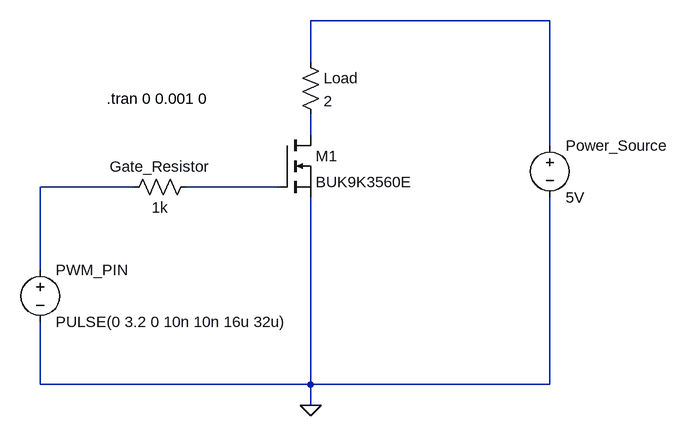
[diagram p0: schematic MosfetDriver.asc]
MosfetDriver.asc, the LTspice schematic file:
Version 4
SHEET 1 1028 680
WIRE 832 -224 464 -224
WIRE 464 -160 464 -224
WIRE 464 -48 464 -80
WIRE 832 -32 832 -224
WIRE 192 32 48 32
WIRE 416 32 272 32
WIRE 48 160 48 32
WIRE 48 336 48 240
WIRE 464 336 464 48
WIRE 464 336 48 336
WIRE 832 336 832 48
WIRE 832 336 464 336
WIRE 464 368 464 336
FLAG 464 368 0
SYMBOL voltage 48 144 R0
WINDOW 123 0 0 Left 0
WINDOW 39 0 0 Left 0
SYMATTR InstName PWM_PIN
SYMATTR Value PULSE(0 3.2 0 10n 10n 16u 32u)
SYMBOL nmos 416 -48 R0
SYMATTR InstName M1
SYMATTR Value BUK9K3560E
SYMBOL voltage 832 -48 R0
WINDOW 123 0 0 Left 0
WINDOW 39 0 0 Left 0
SYMATTR InstName Power_Source
SYMATTR Value 5V
SYMBOL res 448 -176 R0
SYMATTR InstName Load
SYMATTR Value 2
SYMBOL res 288 16 R90
WINDOW 0 0 56 VBottom 2
WINDOW 3 32 56 VTop 2
SYMATTR InstName Gate_Resistor
SYMATTR Value 1k
TEXT 150 -104 Left 2 !.tran 0 0.001 0

The netlist it stands for:
* MosfetDriver.asc
V§PWM_PIN N003 0 PULSE(0 3.2 0 10n 10n 16u 32u)
M1 N002 N004 0 0 BUK9K3560E
V§Power_Source N001 0 5V
R§Load N001 N002 2
R§Gate_Resistor N004 N003 1k
.model NMOS NMOS
.model PMOS PMOS
.lib standard.mos
.tran 0 0.001 0
.backanno
.end